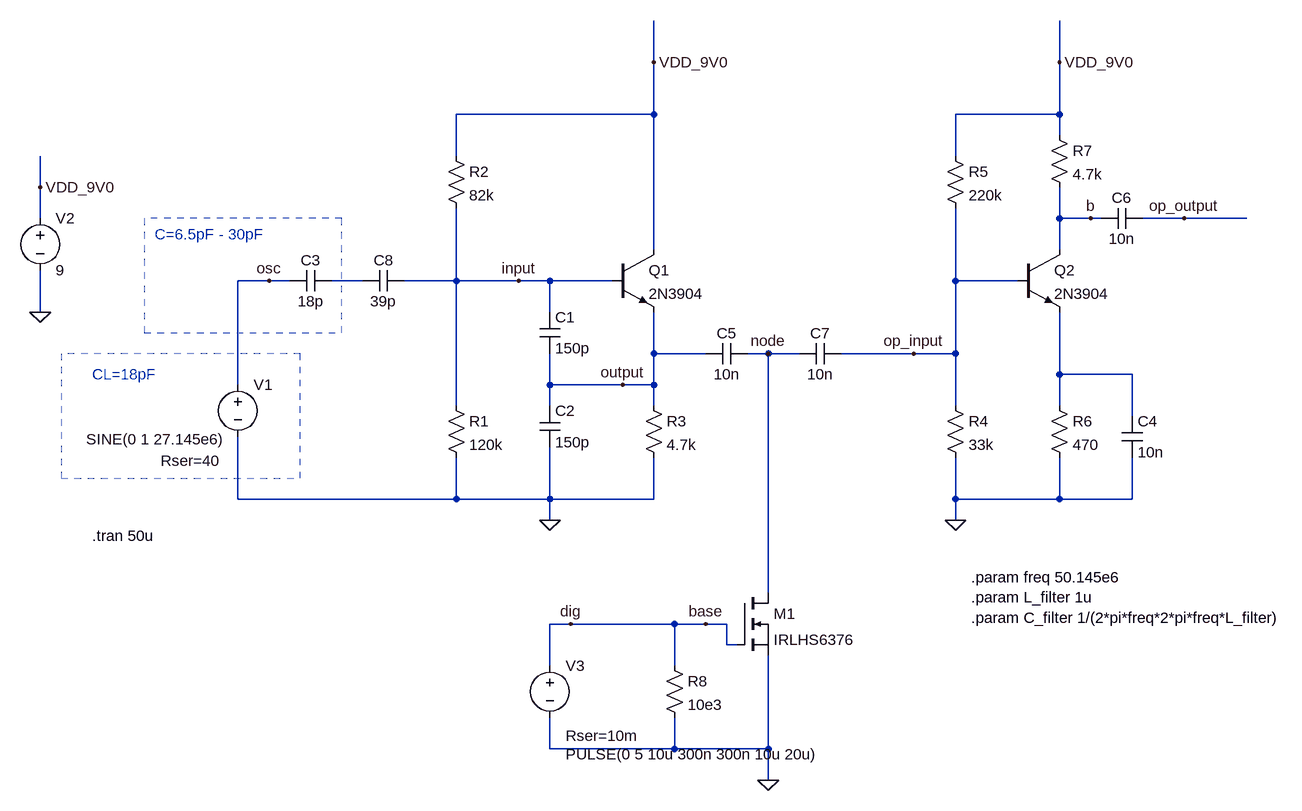
[diagram p0: schematic Transmitter_V2.asc]
Transmitter_V2.asc, the LTspice schematic file:
Version 4
SHEET 1 1600 916
WIRE 480 -208 480 -272
WIRE 1104 -208 1104 -272
WIRE 480 -128 480 -208
WIRE 480 -128 176 -128
WIRE 1104 -128 1104 -208
WIRE 1104 -128 944 -128
WIRE 1104 -96 1104 -128
WIRE 176 -64 176 -128
WIRE 944 -64 944 -128
WIRE -464 -16 -464 -64
WIRE -464 32 -464 -16
WIRE 1104 32 1104 -16
WIRE 1152 32 1104 32
WIRE 1168 32 1152 32
WIRE 1296 32 1232 32
WIRE 1392 32 1296 32
WIRE 480 80 480 -128
WIRE 1104 80 1104 32
WIRE -112 128 -160 128
WIRE -80 128 -112 128
WIRE 32 128 -16 128
WIRE 176 128 176 16
WIRE 176 128 96 128
WIRE 272 128 176 128
WIRE 320 128 272 128
WIRE 416 128 320 128
WIRE 944 128 944 16
WIRE 1040 128 944 128
WIRE -464 176 -464 112
WIRE 320 176 320 128
WIRE 480 240 480 176
WIRE 560 240 480 240
WIRE 656 240 624 240
WIRE 704 240 656 240
WIRE 880 240 768 240
WIRE 944 240 944 128
WIRE 944 240 880 240
WIRE 1104 272 1104 176
WIRE 1216 272 1104 272
WIRE -160 288 -160 128
WIRE 320 288 320 240
WIRE 432 288 320 288
WIRE 480 288 480 240
WIRE 480 288 432 288
WIRE 176 320 176 128
WIRE 320 320 320 288
WIRE 480 320 480 288
WIRE 944 320 944 240
WIRE 1104 320 1104 272
WIRE 1216 336 1216 272
WIRE -160 464 -160 368
WIRE 176 464 176 400
WIRE 176 464 -160 464
WIRE 320 464 320 384
WIRE 320 464 176 464
WIRE 480 464 480 400
WIRE 480 464 320 464
WIRE 944 464 944 400
WIRE 1104 464 1104 400
WIRE 1104 464 944 464
WIRE 1216 464 1216 400
WIRE 1216 464 1104 464
WIRE 320 496 320 464
WIRE 944 496 944 464
WIRE 656 608 656 240
WIRE 352 656 320 656
WIRE 512 656 352 656
WIRE 560 656 512 656
WIRE 592 656 560 656
WIRE 592 688 592 656
WIRE 608 688 592 688
WIRE 320 720 320 656
WIRE 512 720 512 656
WIRE 320 848 320 800
WIRE 512 848 512 800
WIRE 512 848 320 848
WIRE 656 848 656 704
WIRE 656 848 512 848
WIRE 656 896 656 848
FLAG -464 176 0
FLAG -464 -16 VDD_9V0
FLAG 480 -208 VDD_9V0
FLAG 272 128 input
FLAG 432 288 output
FLAG 320 496 0
FLAG 1104 -208 VDD_9V0
FLAG 944 496 0
FLAG 880 240 op_input
FLAG 1296 32 op_output
FLAG 1152 32 b
FLAG -112 128 osc
FLAG 656 896 0
FLAG 352 656 dig
FLAG 560 656 base
FLAG 656 240 node
SYMBOL voltage -160 272 R0
WINDOW 123 0 0 Left 2
WINDOW 39 -119 133 Left 2
WINDOW 3 -233 100 Left 2
SYMATTR SpiceLine Rser=40
SYMATTR InstName V1
SYMATTR Value SINE(0 1 27.145e6)
SYMBOL res 160 304 R0
SYMATTR InstName R1
SYMATTR Value 120k
SYMBOL res 160 -80 R0
SYMATTR InstName R2
SYMATTR Value 82k
SYMBOL cap 304 176 R0
SYMATTR InstName C1
SYMATTR Value 150p
SYMBOL cap 304 320 R0
SYMATTR InstName C2
SYMATTR Value 150p
SYMBOL npn 416 80 R0
SYMATTR InstName Q1
SYMATTR Value 2N3904
SYMBOL voltage -464 16 R0
WINDOW 123 0 0 Left 2
WINDOW 39 0 0 Left 2
SYMATTR InstName V2
SYMATTR Value 9
SYMBOL res 464 304 R0
SYMATTR InstName R3
SYMATTR Value 4.7k
SYMBOL cap -16 112 R90
WINDOW 0 0 32 VBottom 2
WINDOW 3 32 32 VTop 2
SYMATTR InstName C3
SYMATTR Value 18p
SYMBOL res 928 304 R0
SYMATTR InstName R4
SYMATTR Value 33k
SYMBOL res 928 -80 R0
SYMATTR InstName R5
SYMATTR Value 220k
SYMBOL npn 1040 80 R0
SYMATTR InstName Q2
SYMATTR Value 2N3904
SYMBOL res 1088 304 R0
SYMATTR InstName R6
SYMATTR Value 470
SYMBOL res 1088 -112 R0
SYMATTR InstName R7
SYMATTR Value 4.7k
SYMBOL cap 1200 336 R0
SYMATTR InstName C4
SYMATTR Value 10n
SYMBOL cap 624 224 R90
WINDOW 0 0 32 VBottom 2
WINDOW 3 32 32 VTop 2
SYMATTR InstName C5
SYMATTR Value 10n
SYMBOL cap 1232 16 R90
WINDOW 0 0 32 VBottom 2
WINDOW 3 32 32 VTop 2
SYMATTR InstName C6
SYMATTR Value 10n
SYMBOL res 496 704 R0
SYMATTR InstName R8
SYMATTR Value 10e3
SYMBOL voltage 320 704 R0
WINDOW 3 24 152 Left 2
WINDOW 123 0 0 Left 2
WINDOW 39 24 124 Left 2
SYMATTR Value PULSE(0 5 10u 300n 300n 10u 20u)
SYMATTR SpiceLine Rser=10m
SYMATTR InstName V3
SYMBOL cap 768 224 R90
WINDOW 0 0 32 VBottom 2
WINDOW 3 32 32 VTop 2
SYMATTR InstName C7
SYMATTR Value 10n
SYMBOL nmos 608 608 R0
SYMATTR InstName M1
SYMATTR Value IRLHS6376
SYMBOL cap 96 112 R90
WINDOW 0 0 32 VBottom 2
WINDOW 3 32 32 VTop 2
SYMATTR InstName C8
SYMATTR Value 39p
TEXT -384 520 Left 2 !.tran 50u
TEXT 968 584 Left 2 !.param freq 50.145e6\n.param L_filter 1u\n.param C_filter 1/(2*pi*freq*2*pi*freq*L_filter)
TEXT -384 272 Left 2 ;CL=18pF
TEXT -288 56 Left 2 ;C=6.5pF - 30pF
RECTANGLE Normal -432 432 -64 240 2
RECTANGLE Normal -304 208 0 32 2

The netlist it stands for:
* Transmitter_V2.asc
V1 osc 0 SINE(0 1 27.145e6) Rser=40
R1 input 0 120k
R2 VDD_9V0 input 82k
C1 input output 150p
C2 output 0 150p
Q1 VDD_9V0 input output 0 2N3904
V2 VDD_9V0 0 9
R3 output 0 4.7k
C3 N001 osc 18p
R4 op_input 0 33k
R5 VDD_9V0 op_input 220k
Q2 b op_input N002 0 2N3904
R6 N002 0 470
R7 VDD_9V0 b 4.7k
C4 N002 0 10n
C5 node output 10n
C6 op_output b 10n
R8 base 0 10e3
V3 base 0 PULSE(0 5 10u 300n 300n 10u 20u) Rser=10m
C7 op_input node 10n
M1 node base 0 0 IRLHS6376
C8 input N001 39p
.model NPN NPN
.model PNP PNP
.lib standard.bjt
.model NMOS NMOS
.model PMOS PMOS
.lib standard.mos
.tran 50u
.param freq 50.145e6
.param L_filter 1u
.param C_filter 1/(2*pi*freq*2*pi*freq*L_filter)
* CL=18pF
* C=6.5pF - 30pF
.backanno
.end